# Altium schematic sheet Xilinx JTAG Header.SchDoc
size A4
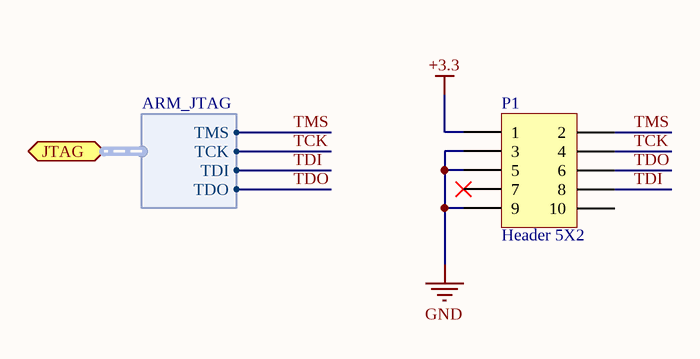
[diagram p0: Xilinx JTAG Header.SchDoc]

## Parts
P1  Header 5X2  [FTSH-105-01-L-DV]

## Ports
JTAG (harness ARM_JTAG)

## Harnesses
ARM_JTAG: TDI, TMS, TCK, TDO

## Nets
+3.3: P1.1
GND: P1.3 P1.5 P1.9
TCK: P1.4 ; port JTAG.TCK
TDI: P1.8 ; port JTAG.TDI
TDO: P1.6 ; port JTAG.TDO
TMS: P1.2 ; port JTAG.TMS

Not connected (* = marked no-connect by the designer): P1 7* 10

## Library data of the parts
P1 = Header 5X2: Header, 5-Pin, Dual row; LatestRevisionDate: 17-Jul-2002; LatestRevisionNote: Re-released for DXP Platform.; Publisher: Altium Limited; farnell: 1667759